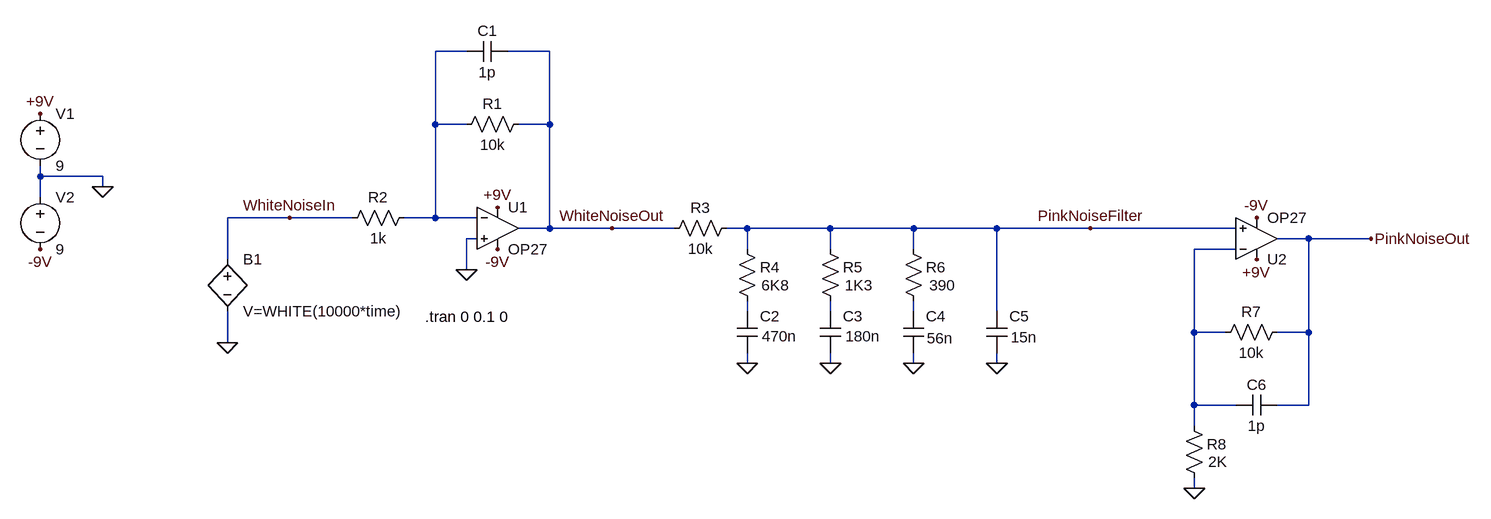
[diagram p0: schematic White_Pink_Noise.asc]
White_Pink_Noise.asc, the LTspice schematic file:
Version 4
SHEET 1 2908 1132
WIRE 912 -48 864 -48
WIRE 1040 -48 976 -48
WIRE 864 64 864 -48
WIRE 912 64 864 64
WIRE 1040 64 1040 -48
WIRE 1040 64 992 64
WIRE 256 144 256 128
WIRE 352 144 256 144
WIRE 352 160 352 144
WIRE 256 176 256 144
WIRE 640 208 544 208
WIRE 736 208 640 208
WIRE 864 208 864 64
WIRE 864 208 816 208
WIRE 928 208 864 208
WIRE 1040 224 1040 64
WIRE 1040 224 992 224
WIRE 1136 224 1040 224
WIRE 1232 224 1136 224
WIRE 1344 224 1312 224
WIRE 1472 224 1344 224
WIRE 1600 224 1472 224
WIRE 1728 224 1600 224
WIRE 1872 224 1728 224
WIRE 2096 224 1872 224
WIRE 928 240 912 240
WIRE 2208 240 2160 240
WIRE 2304 240 2208 240
WIRE 1344 256 1344 224
WIRE 1472 256 1472 224
WIRE 1600 256 1600 224
WIRE 2096 256 2032 256
WIRE 544 272 544 208
WIRE 912 288 912 240
WIRE 1344 352 1344 336
WIRE 1472 352 1472 336
WIRE 1600 352 1600 336
WIRE 1728 352 1728 224
WIRE 2032 384 2032 256
WIRE 2080 384 2032 384
WIRE 2208 384 2208 240
WIRE 2208 384 2160 384
WIRE 544 400 544 352
WIRE 1344 432 1344 416
WIRE 1472 432 1472 416
WIRE 1600 432 1600 416
WIRE 1728 432 1728 416
WIRE 2032 496 2032 384
WIRE 2096 496 2032 496
WIRE 2208 496 2208 384
WIRE 2208 496 2160 496
WIRE 2032 528 2032 496
WIRE 2032 624 2032 608
FLAG 1136 224 WhiteNoiseOut
FLAG 352 160 0
FLAG 256 48 +9V
FLAG 256 256 -9V
FLAG 960 256 -9V
FLAG 960 192 +9V
FLAG 912 288 0
FLAG 544 400 0
FLAG 640 208 WhiteNoiseIn
FLAG 1344 432 0
FLAG 1472 432 0
FLAG 1600 432 0
FLAG 1728 432 0
FLAG 1872 224 PinkNoiseFilter
FLAG 2304 240 PinkNoiseOut
FLAG 2128 208 -9V
FLAG 2128 272 +9V
FLAG 2032 624 0
SYMBOL res 1008 48 R90
WINDOW 0 0 56 VBottom 2
WINDOW 3 32 56 VTop 2
SYMATTR InstName R1
SYMATTR Value 10k
SYMBOL res 832 192 R90
WINDOW 0 0 56 VBottom 2
WINDOW 3 32 56 VTop 2
SYMATTR InstName R2
SYMATTR Value 1k
SYMBOL voltage 256 32 R0
SYMATTR InstName V1
SYMATTR Value 9
SYMBOL voltage 256 160 R0
SYMATTR InstName V2
SYMATTR Value 9
SYMBOL Opamps/OP27 960 160 R0
SYMATTR InstName U1
SYMBOL cap 976 -64 R90
WINDOW 0 0 32 VBottom 2
WINDOW 3 32 32 VTop 2
SYMATTR InstName C1
SYMATTR Value 1p
SYMBOL bv 544 256 R0
SYMATTR InstName B1
SYMATTR Value V=WHITE(10000*time)
SYMBOL res 1328 208 R90
WINDOW 0 0 56 VBottom 2
WINDOW 3 32 56 VTop 2
SYMATTR InstName R3
SYMATTR Value 10k
SYMBOL cap 1360 416 R180
WINDOW 0 -34 57 Left 2
WINDOW 3 -61 26 Left 2
SYMATTR InstName C2
SYMATTR Value 470n
SYMBOL res 1360 352 R180
WINDOW 0 -34 68 Left 2
WINDOW 3 -49 40 Left 2
SYMATTR InstName R4
SYMATTR Value 6K8
SYMBOL cap 1488 416 R180
WINDOW 0 -34 57 Left 2
WINDOW 3 -61 26 Left 2
SYMATTR InstName C3
SYMATTR Value 180n
SYMBOL res 1488 352 R180
WINDOW 0 -34 68 Left 2
WINDOW 3 -49 40 Left 2
SYMATTR InstName R5
SYMATTR Value 1K3
SYMBOL cap 1616 416 R180
WINDOW 0 -34 57 Left 2
WINDOW 3 -45 23 Left 2
SYMATTR InstName C4
SYMATTR Value 56n
SYMBOL res 1616 352 R180
WINDOW 0 -34 68 Left 2
WINDOW 3 -49 40 Left 2
SYMATTR InstName R6
SYMATTR Value 390
SYMBOL cap 1744 416 R180
WINDOW 0 -34 57 Left 2
WINDOW 3 -46 24 Left 2
SYMATTR InstName C5
SYMATTR Value 15n
SYMBOL res 2064 400 R270
WINDOW 0 32 56 VTop 2
WINDOW 3 0 56 VBottom 2
SYMATTR InstName R7
SYMATTR Value 10k
SYMBOL Opamps/OP27 2128 304 M180
SYMATTR InstName U2
SYMBOL cap 2096 512 R270
WINDOW 0 32 32 VTop 2
WINDOW 3 0 32 VBottom 2
SYMATTR InstName C6
SYMATTR Value 1p
SYMBOL res 2048 624 R180
WINDOW 0 -34 68 Left 2
WINDOW 3 -35 41 Left 2
SYMATTR InstName R8
SYMATTR Value 2K
TEXT 848 360 Left 2 !.tran 0 0.1 0

The netlist it stands for:
* White_Pink_Noise.asc
R1 WhiteNoiseOut N001 10k
R2 N001 WhiteNoiseIn 1k
V1 +9V 0 9
V2 0 -9V 9
XU1 0 N001 +9V -9V WhiteNoiseOut OP27  ; pins In+ In- V+ V- OUT
C1 WhiteNoiseOut N001 1p
B1 WhiteNoiseIn 0 V=WHITE(10000*time)
R3 PinkNoiseFilter WhiteNoiseOut 10k
C2 0 N003 470n
R4 N003 PinkNoiseFilter 6K8
C3 0 N004 180n
R5 N004 PinkNoiseFilter 1K3
C4 0 N005 56n
R6 N005 PinkNoiseFilter 390
C5 0 PinkNoiseFilter 15n
R7 N002 PinkNoiseOut 10k
XU2 PinkNoiseFilter N002 +9V -9V PinkNoiseOut OP27  ; pins In+ In- V+ V- OUT
C6 N002 PinkNoiseOut 1p
R8 0 N002 2K
.tran 0 0.1 0
.lib ADI.lib
.backanno
.end